# EAGLE schematic power_supply (EAGLE 6.6.0)
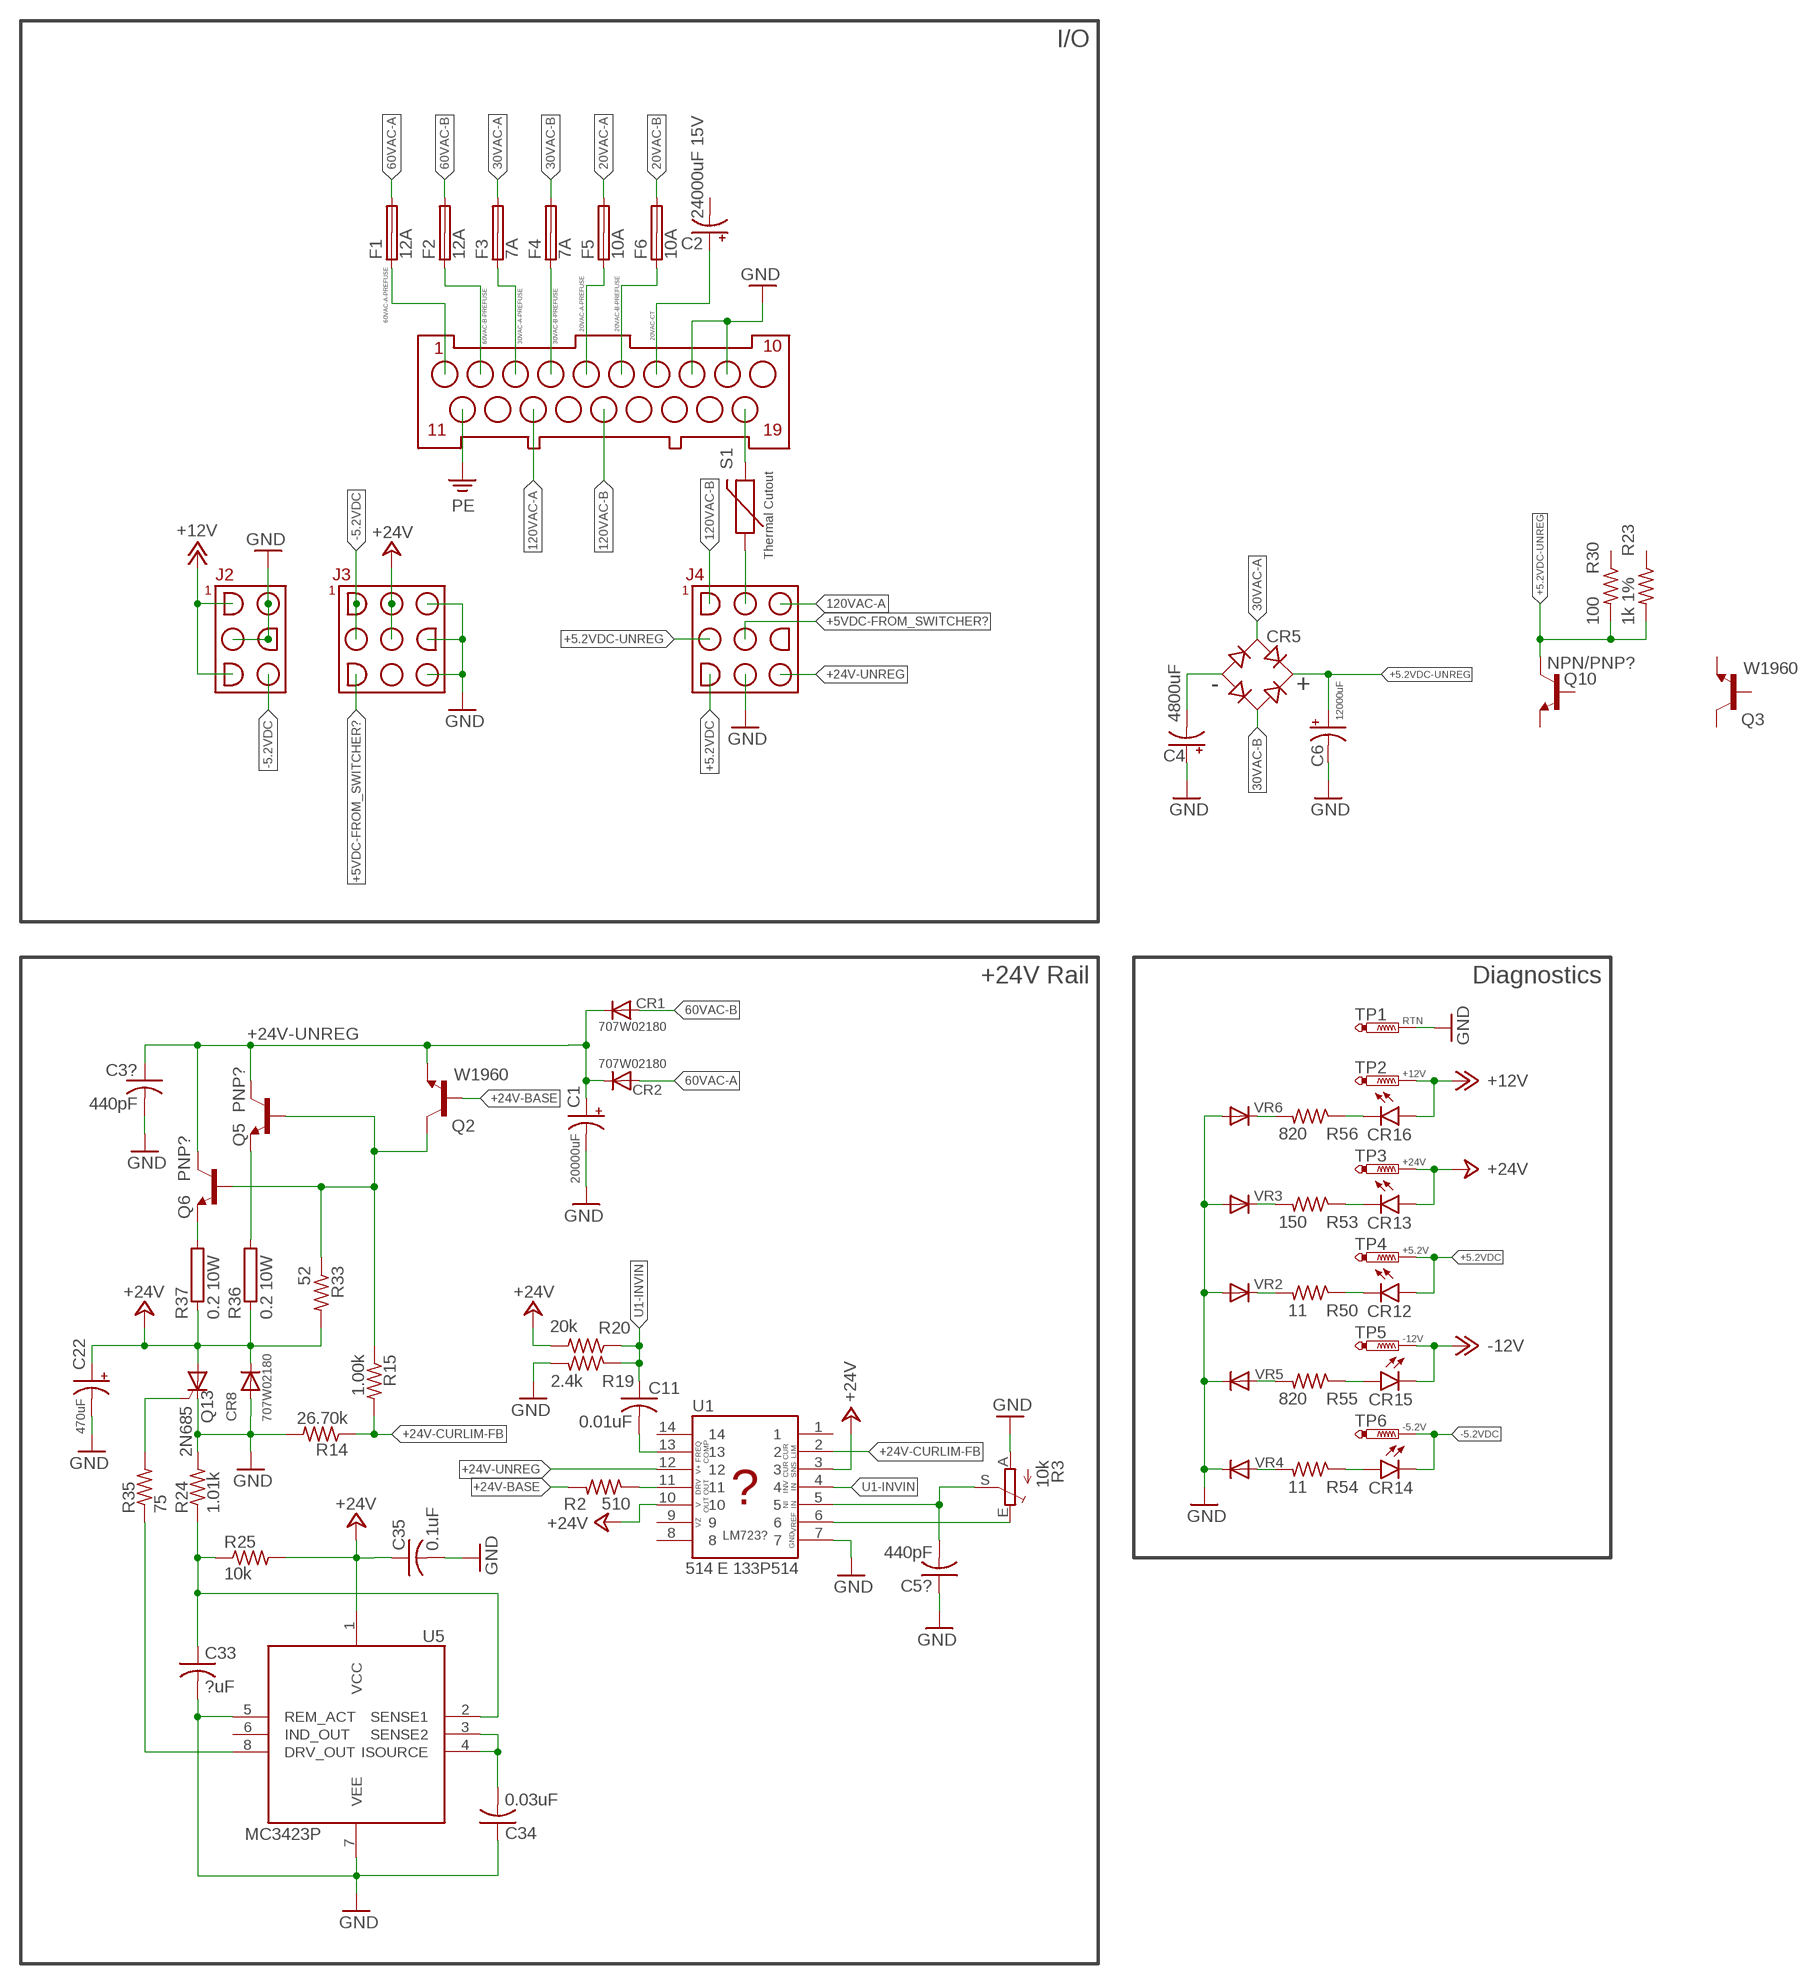
[diagram p0: schematic, sheet 1]

## Parts
C1  20000uF  CPOL-US153CLV-0505  [153CLV-0505]
C2  24000uF 15V  CPOL-US153CLV-0505  [153CLV-0505]
C3?  440pF  C-US102-043X133  [C102-043X133]
C4  4800uF  CPOL-US153CLV-0505  [153CLV-0505]
C5?  440pF  C-US102-043X133  [C102-043X133]
C6  12000uF  CPOL-US153CLV-0505  [153CLV-0505]
C11  0.01uF  C-US102-043X133  [C102-043X133]
C22  470uF  CPOL-US153CLV-0505  [153CLV-0505]
C33  ?uF  C-US102-043X133  [C102-043X133]
C34  0.03uF  C-US102-043X133  [C102-043X133]
C35  0.1uF  C-US102-043X133  [C102-043X133]
CR1  707W02180  GF1  [SMA-DO214AC]
CR2  707W02180  GF1  [SMA-DO214AC]
CR5  RECTIFIER-2KBB-R  [2KBB-R]
CR8  707W02180  GF1  [SMA-DO214AC]
CR12  LED5MM  [LED5MM]
CR13  LED5MM  [LED5MM]
CR14  LED5MM  [LED5MM]
CR15  LED5MM  [LED5MM]
CR16  LED5MM  [LED5MM]
F1  12A  SH32  [SH32]
F2  12A  SH32  [SH32]
F3  7A  SH32  [SH32]
F4  7A  SH32  [SH32]
F5  10A  SH32  [SH32]
F6  10A  SH32  [SH32]
J1  From Transformer  AMP-METRIMATE-19  [AMP-METRIMATE-19]
J2  MOLEX-MLX3X2  [MOLEX-MLX3X2]
J3  TBD  MOLEX-MLX3X3  [MOLEX-MLX3X3]
J4  To Switcher Board  MOLEX-MLX3X3  [MOLEX-MLX3X3]
Q2  W1960  2N3054  [TO66]
Q3  W1960  2N3054  [TO66]
Q5  PNP?  -NPN-TO3/  [TO3]
Q6  PNP?  -NPN-TO3/  [TO3]
Q10  NPN/PNP?  -NPN-TO3/  [TO3]
Q13  2N685  BTR59  [SOT93S]
R2  510  R-US_0207/15  [0207/15]
R3  10k  TRIM_EU-RS3  [RS3]
R14  26.70k  R-US_0207/15  [0207/15]
R15  1.00k  R-US_0207/15  [0207/15]
R19  2.4k  R-US_0207/15  [0207/15]
R20  20k  R-US_0207/15  [0207/15]
R23  1k 1%  R-US_0207/15  [0207/15]
R24  1.01k  R-US_0207/15  [0207/15]
R25  10k  R-US_0207/15  [0207/15]
R30  100  R-US_0207/15  [0207/15]
R33  52  R-US_0207/15  [0207/15]
R35  75  R-US_0207/15  [0207/15]
R36  0.2 10W  RCA5220  [CA5220]
R37  0.2 10W  RCA5220  [CA5220]
R50  11  R-US_0207/15  [0207/15]
R53  150  R-US_0207/15  [0207/15]
R54  11  R-US_0207/15  [0207/15]
R55  820  R-US_0207/15  [0207/15]
R56  820  R-US_0207/15  [0207/15]
S1  Thermal Cutout  PTC0603  [0603]
TP1  RTN  PTR1TP08SQ  [TP08SQ]
TP2  RTN  PTR1TP08SQ  [TP08SQ]
TP3  RTN  PTR1TP08SQ  [TP08SQ]
TP4  RTN  PTR1TP08SQ  [TP08SQ]
TP5  RTN  PTR1TP08SQ  [TP08SQ]
TP6  RTN  PTR1TP08SQ  [TP08SQ]
U1  514 E 133P514  UNKNOWN-14PIN  [DIL14]
U5  MC3423P  [DIL08]
VR2  GF1  [SMA-DO214AC]
VR3  GF1  [SMA-DO214AC]
VR4  GF1  [SMA-DO214AC]
VR5  GF1  [SMA-DO214AC]
VR6  GF1  [SMA-DO214AC]

## Nets
20VAC-A: F5.2A
20VAC-A-PREFUSE: F5.1A J1.5
20VAC-B: F6.2A
20VAC-B-PREFUSE: F6.1A J1.6
20VAC-CT: C2.+ J1.7
30VAC-A: CR5.AC1 F3.2A
30VAC-A-PREFUSE: F3.1A J1.3
30VAC-B: CR5.AC2 F4.2A
30VAC-B-PREFUSE: F4.1A J1.4
60VAC-A: CR2.A F1.2A
60VAC-A-PREFUSE: F1.1A J1.1
60VAC-B: CR1.A F2.2A
60VAC-B-PREFUSE: F2.1A J1.2
120VAC-A: J1.13 J4.7
120VAC-B: J1.15 J4.1
+5.2VDC: CR12.A J4.3 TP4.TP
+5.2VDC-UNREG: C6.+ CR5.+ J4.2 Q10.C R23.2 R30.2
+5VDC-FROM_SWITCHER?: J3.3 J4.5
+12V: CR16.A J2.4 J2.6 TP2.TP
+24V: C22.+ C35.1 CR8.K(C) CR13.A J3.4 J3.5 Q13.A R20.2 R25.2 R33.2 R36.1 R37.1 TP3.TP U1.3 U1.10 U5.1(VCC)
+24V-BASE: Q2.2(B) R2.2
+24V-BASEDRIVE: Q2.3(C) Q2.TO66(C) Q5.B Q6.B R15.1 R33.1
+24V-CURLIM-FB: R14.1 R15.2 U1.2
+24V-UNREG: C1.+ C3?.1 CR1.K(C) CR2.K(C) J4.9 Q2.1(E) Q5.C Q6.C U1.12
-5.2VDC: CR14.K(C) J2.1 J3.1 J3.2 TP6.TP
-12V: CR15.K(C) TP5.TP
GND: C1.- C3?.2 C4.+ C5?.1 C6.- C22.- C33.2 C34.1 C35.2 CR8.A J1.8 J1.9 J2.2 J2.3 J2.5 J3.7 J3.8 J3.9 J4.6 Q13.C R3.A R14.2 R19.2 R24.2 TP1.TP U1.7 U5.5(REM_ACT) U5.7(VEE) VR2.A VR3.A VR4.K(C) VR5.K(C) VR6.A
N$4: J4.4 S1.1
N$8: C33.1 R24.1 R25.1 U5.2(SENSE1)
N$10: Q6.E R37.2
N$11: C4.- CR5.-
N$12: Q5.E R36.2
N$14: C34.2 U5.3(SENSE2) U5.4(ISOURCE)
N$15: R2.1 U1.11
N$16: Q13.G R35.2
N$17: CR14.A R54.1
N$18: CR16.K(C) R56.1
N$19: CR13.K(C) R53.1
N$20: R35.1 U5.8(DRV_OUT)
N$21: CR12.K(C) R50.1
N$22: CR15.A R55.1
N$23: R54.2 VR4.A
N$25: R55.2 VR5.A
N$26: R50.2 VR2.K(C)
N$27: R53.2 VR3.K(C)
N$28: R56.2 VR6.K(C)
PE: J1.11
S1: J1.19 S1.2
U1-5: C5?.2 R3.S U1.5
U1-6: R3.E U1.6
U1-FREQCOMP: C11.2 U1.13
U1-INVIN: C11.1 R19.1 R20.1 U1.4
Unconnected: C2.- F1.1B F1.2B F2.1B F2.2B F3.1B F3.2B F4.1B F4.2B F5.1B F5.2B F6.1B F6.2B J1.10 J1.12 J1.14 J1.16 J1.17 J1.18 J3.6 J4.8 Q3.1(E) Q3.2(B) Q3.3(C) Q3.TO66(C) Q10.B Q10.E R23.1 R30.1 U1.1 U1.8 U1.9 U1.14 U5.6(IND_OUT)

## Notes on the sheet
- I/O
- - | +
- +24V Rail | Diagnostics
- RTN
- +12V
- +24V
- +5.2V
- -12V
- -5.2V
- FREQ
  COMP
- CUR
  LIM
- V+
- CUR
  SNS
- DRV
  OUT
- INV
  IN
- V
  OUT
- NI
  IN
- VZ | VREF
- LM723? | GND

## Library data of the parts
C1 C2 C4 C6 C22 = rcl:CPOL-US: POLARIZED CAPACITOR, American symbol
C3? C5? C11 C33-C35 = rcl:C-US: CAPACITOR, American symbol
CR1 CR2 CR8 VR2-VR6 = diode:GF1: DIODE
CR5 = rectifier:RECTIFIER-: Rectifier
CR12-CR16 = SparkFun-LED:LED: LEDs Standard schematic elements and footprints for 5mm, 3mm, 1206, and 0603 sized LEDs. 5mm - Spark Fun Electronics SKU : COM-00529 (and others)
F1-F6 = fuse:SH32: FUSE HOLDER 6 x 32 mm, SH contact, SHH3N Schukat, 102071 Wickmann (Buerklin); MPN: 10207101009; OC_FARNELL: 811786; OC_NEWARK: 76R6904
J1 = con-sen:AMP-METRIMATE-19
J2 = con-sen:MOLEX-MLX3X2
J3 J4 = con-sen:MOLEX-MLX3X3
Q2 Q3 = transistor-npn:2N3054: NPN Transistor
Q5 Q6 Q10 = transistor:*-NPN-: NPN Transistror BF959 corrected 2008.03.06
Q13 = triac:BTR59: THYRISTOR
R2 R14 R15 R19 R20 R23-R25 R30 R33 R35 R50 R53-R56 = rcl:R-US_: RESISTOR, American symbol
R3 = pot:TRIM_EU-: POTENTIOMETER
R36 R37 = resistor-power:R: Power Resitor; OC_FARNELL: unknown; OC_NEWARK: unknown
S1 = SparkFun-PowerIC:PTC: Resettable Fuse PTC Resettable Fuse. Spark Fun Electronics SKU : COM-08357
TP1-TP6 = testpad:PTR1: TEST PIN
U1 = unknown-sen:UNKNOWN-14PIN
U5 = onsemi-sen:MC3423: Overvoltage Crowbar Sensing Circuit